# Altium schematic sheet Motor Driver.SchDoc
size A4; Organization: ENEL429 Group N; Address1: ECE Department; Address2: University of Canterbury; Address3: Christchurch 8041; Address4: New Zealand; Revision: 1
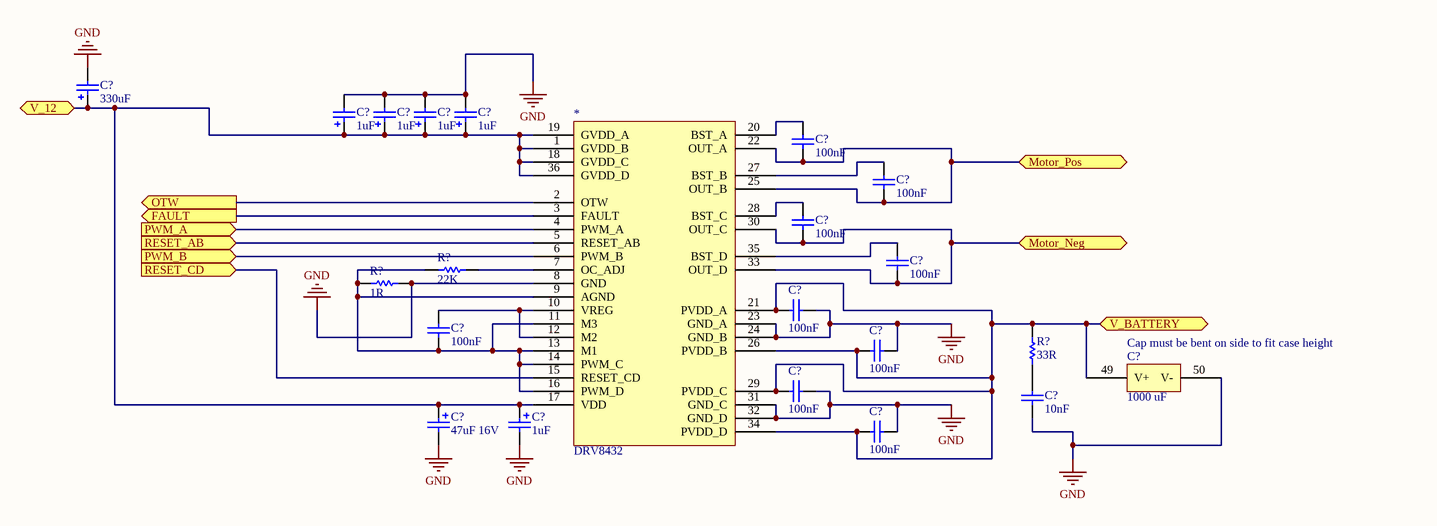
[diagram p0: Motor Driver.SchDoc]

## Parts
(Parts that share a designator on the sheet are numbered #1, #2 ... from top to bottom, then left to right.)
*  DRV8432
C?#1  330uF  [RB0.1-0.2]
C?#2  1uF  [RB0.1-0.2]
C?#3  1uF  [RB0.1-0.2]
C?#4  1uF  [RB0.1-0.2]
C?#5  1uF  [RB0.1-0.2]
C?#6  100nF  [CC0805]
C?#7  100nF  [CC0805]
C?#8  100nF  [CC0805]
C?#9  100nF  [CC0805]
C?#10  100nF  [CC0805]
C?#11  100nF  [CC0805]
C?#12  100nF  [CC0805]
C?#13  1000 uF
C?#14  100nF  [CC0805]
C?#15  10nF  [CC0603]
C?#16  47uF 16V  [TANT7343]
C?#17  1uF  [RB0.1-0.2]
C?#18  100nF  [CC0805]
R?#1  22K  [R0603]
R?#2  1R  [R0603]
R?#3  33R  [R0603]

## Ports
FAULT (out), Motor_Neg, Motor_Pos, OTW (out), PWM_A (in), PWM_B (in), RESET_AB (in), RESET_CD (in), V_12, V_BATTERY

## Nets
GND: *.8(GND) *.23(GND_A) *.24(GND_B) *.31(GND_C) *.32(GND_D) C?#1.2 C?#2.2 C?#3.2 C?#4.2 C?#5.2 C?#10.1 C?#12.1 C?#13.50(V-) C?#14.1 C?#15.1 C?#16.2 C?#17.2 C?#18.1 R?#2.2
FAULT: *.3(FAULT) ; port FAULT
Motor_Neg: *.30(OUT_C) *.33(OUT_D) C?#8.1 C?#9.1 ; port Motor_Neg
Motor_Pos: *.22(OUT_A) *.25(OUT_B) C?#6.1 C?#7.1 ; port Motor_Pos
OTW: *.2(OTW) ; port OTW
PWM_A: *.4(PWM_A) ; port PWM_A
PWM_B: *.6(PWM_B) ; port PWM_B
RESET_AB: *.5(RESET_AB) ; port RESET_AB
RESET_CD: *.15(RESET_CD) ; port RESET_CD
V_12: *.1(GVDD_B) *.17(VDD) *.18(GVDD_C) *.19(GVDD_A) *.36(GVDD_D) C?#1.1 C?#2.1 C?#3.1 C?#4.1 C?#5.1 C?#16.1 C?#17.1 ; port V_12
V_BATTERY: *.21(PVDD_A) *.26(PVDD_B) *.29(PVDD_C) *.34(PVDD_D) C?#10.2 C?#12.2 C?#13.49(V+) C?#14.2 C?#18.2 R?#3.2 ; port V_BATTERY
Net*_7: *.7(OC_ADJ) R?#1.2
Net*_9: *.9(AGND) *.11(M3) *.13(M1) *.14(PWM_C) *.16(PWM_D) C?#11.1 R?#1.1 R?#2.1
Net*_10: *.10(VREG) *.12(M2) C?#11.2
Net*_20: *.20(BST_A) C?#6.2
Net*_27: *.27(BST_B) C?#7.2
Net*_28: *.28(BST_C) C?#8.2
Net*_35: *.35(BST_D) C?#9.2
NetC?#15_2: C?#15.2 R?#3.1

## Notes on the sheet
- (near C?#13) Cap must be bent on side to fit case height
- Title
- Drawn by:
- Date:
- Time:
- Revision:
- Sheet
- of
- File:

## Library data of the parts
C?#1-C?#5 C?#17 = 1uF_63V_RB0.1-0.2: 1uF 63V Electrolytic Cap; Supplier_Component_Code: RE-6032; published: 27/09/2006; Supplier_Name: Soanar Plus; price: 0.08; Part Number: 1uF_63V_RB0.1-0.2; Component Kind: Standard; Component Type: Standard; Designator: 1uF_63V_RB0.1-0.2; Pin Count: 2
  C?#1: value: 330uF
  C?#2-C?#5 C?#17: value: 1uF
C?#6-C?#12 C?#14 C?#18 = 100nF_CC0805: 0805 Capacitor; Supplier_Component_Code: RC-P133; published: 28/03/2007 10:54:57 a.m.; Supplier_Name: Soanar Plus; price: 0.1; value: 100nF; Part Number: 100nF_CC0805; Component Kind: Standard; Component Type: Standard; Designator: 100nF_CC0805; Pin Count: 2
C?#13 = EEUFK1V102L: Supplier: element 14; supplier part number: 1744967
C?#15 = 10nF_CC0603: 0603 Capacitor; Supplier_Component_Code: RC-P097; published: 28/03/2007 10:54:57 a.m.; Supplier_Name: Soanar Plus; price: 0.09; value: 10nF; Part Number: 10nF_CC0603; Component Kind: Standard; Component Type: Standard; Designator: 10nF_CC0603; Pin Count: 2
C?#16 = TANT47uF_16V_7343: SM Tantalum Cap; Supplier_Component_Code: RZ-6574; published: 12/03/2007 11:34:36 a.m.; Supplier_Name: Soanar Plus; price: 1.9; value: 47uF 16V; Part Number: TANT47uF_16V_7343; Component Kind: Standard; Component Type: Standard; Designator: TANT47uF_16V_7343; Pin Count: 2
R?#1 = 22K_R0603: 0603 Resistor; ECE_Component_Code: 22K_R0603; value: 22K; Supplier_Component_Code: RS-S105; published: 12/03/2007 11:34:34 a.m.; Supplier_Name: Soanar Plus; price: 0.08; Part Number: 22K_R0603; Component Kind: Standard; Component Type: Standard; Designator: 22K_R0603; Pin Count: 2
R?#2 = 1R_R0603: 0603 Resistor; ECE_Component_Code: 1R_R0603; value: 1R; Supplier_Component_Code: RS-S001; published: 12/03/2007 11:34:33 a.m.; Supplier_Name: Soanar Plus; price: 0.08; Part Number: 1R_R0603; Component Kind: Standard; Component Type: Standard; Designator: 1R_R0603; Pin Count: 2
R?#3 = 33R_R0603: 0603 Resistor; ECE_Component_Code: 33R_R0603; value: 33R; Supplier_Component_Code: RS-S037; published: 12/03/2007 11:34:34 a.m.; Supplier_Name: Soanar Plus; price: 0.08; Part Number: 33R_R0603; Component Kind: Standard; Component Type: Standard; Designator: 33R_R0603; Pin Count: 2